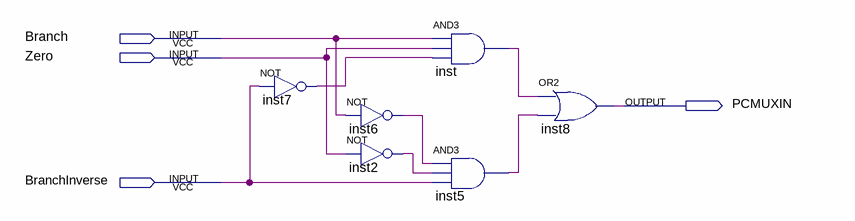
[diagram p0: schematic sheet]
// Quartus schematic q1.bdf as structural Verilog: 6 symbols, 4 pins
module q1 (
  input  Branch,
  input  Zero,
  input  BranchInverse,
  output PCMUXIN
);

  wire inst2_out, inst5_out, inst6_out, inst7_out, inst_out;

  not inst7 (inst7_out, BranchInverse);
  not inst6 (inst6_out, Branch);
  not inst2 (inst2_out, Zero);
  and inst (inst_out, Branch, Zero, inst7_out);
  and inst5 (inst5_out, inst6_out, inst2_out, BranchInverse);
  or inst8 (PCMUXIN, inst_out, inst5_out);
endmodule
